# EAGLE schematic ATtiny4313_PN532_Cable (EAGLE 6.5.0)
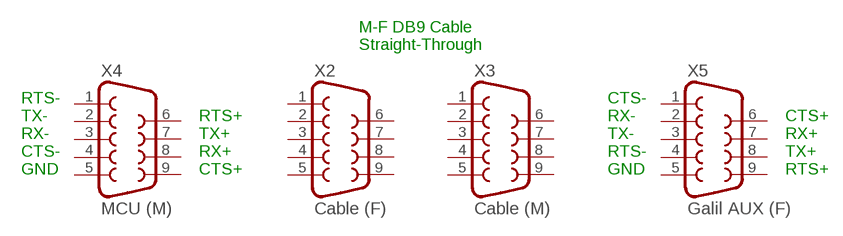
[diagram p0: schematic, sheet 1]

## Parts
X2  Cable (F)  DB9FEMALE  [DB9]
X3  Cable (M)  DB9MALE  [DB9_MALE]
X4  MCU (M)  DB9MALE  [DB9_MALE]
X5  Galil AUX (F)  DB9FEMALE  [DB9]
Unconnected: X2.1 X2.2 X2.3 X2.4 X2.5 X2.6 X2.7 X2.8 X2.9 X3.1 X3.2 X3.3 X3.4 X3.5 X3.6 X3.7 X3.8 X3.9 X4.1 X4.2 X4.3 X4.4 X4.5 X4.6 X4.7 X4.8 X4.9 X5.1 X5.2 X5.3 X5.4 X5.5 X5.6 X5.7 X5.8 X5.9

## Notes on the sheet
- M-F DB9 Cable
  Straight-Through
- RTS- | CTS-
- TX- | RTS+ | RX- | CTS+
- RX- | TX+ | TX- | RX+
- CTS- | RX+ | RTS- | TX+
- GND | CTS+ | GND | RTS+

## Library data of the parts
X2-X5 = SparkFun-Connectors:DB9: DB9 Connector Standard DB9 (D-Sub 9) serial connector. Can be used for CAN bus as well as RS485 and RS232. Footprint production proven. Spark Fun Electronics SKU : PRT-00429